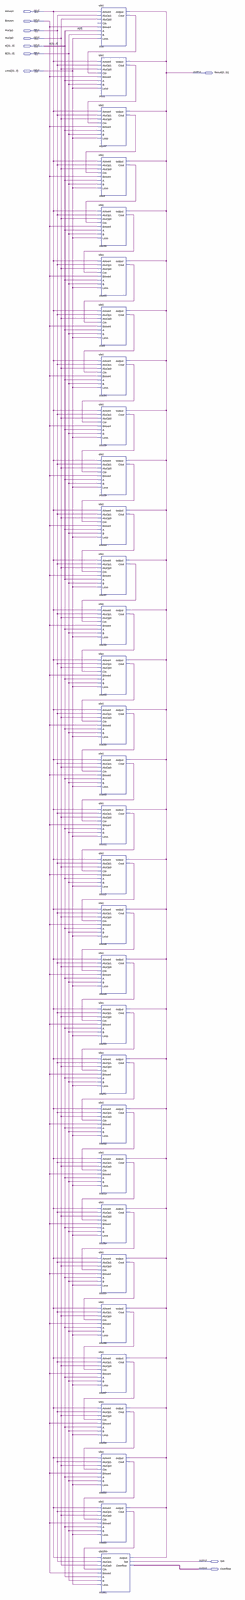
[diagram p0: schematic sheet, whole]
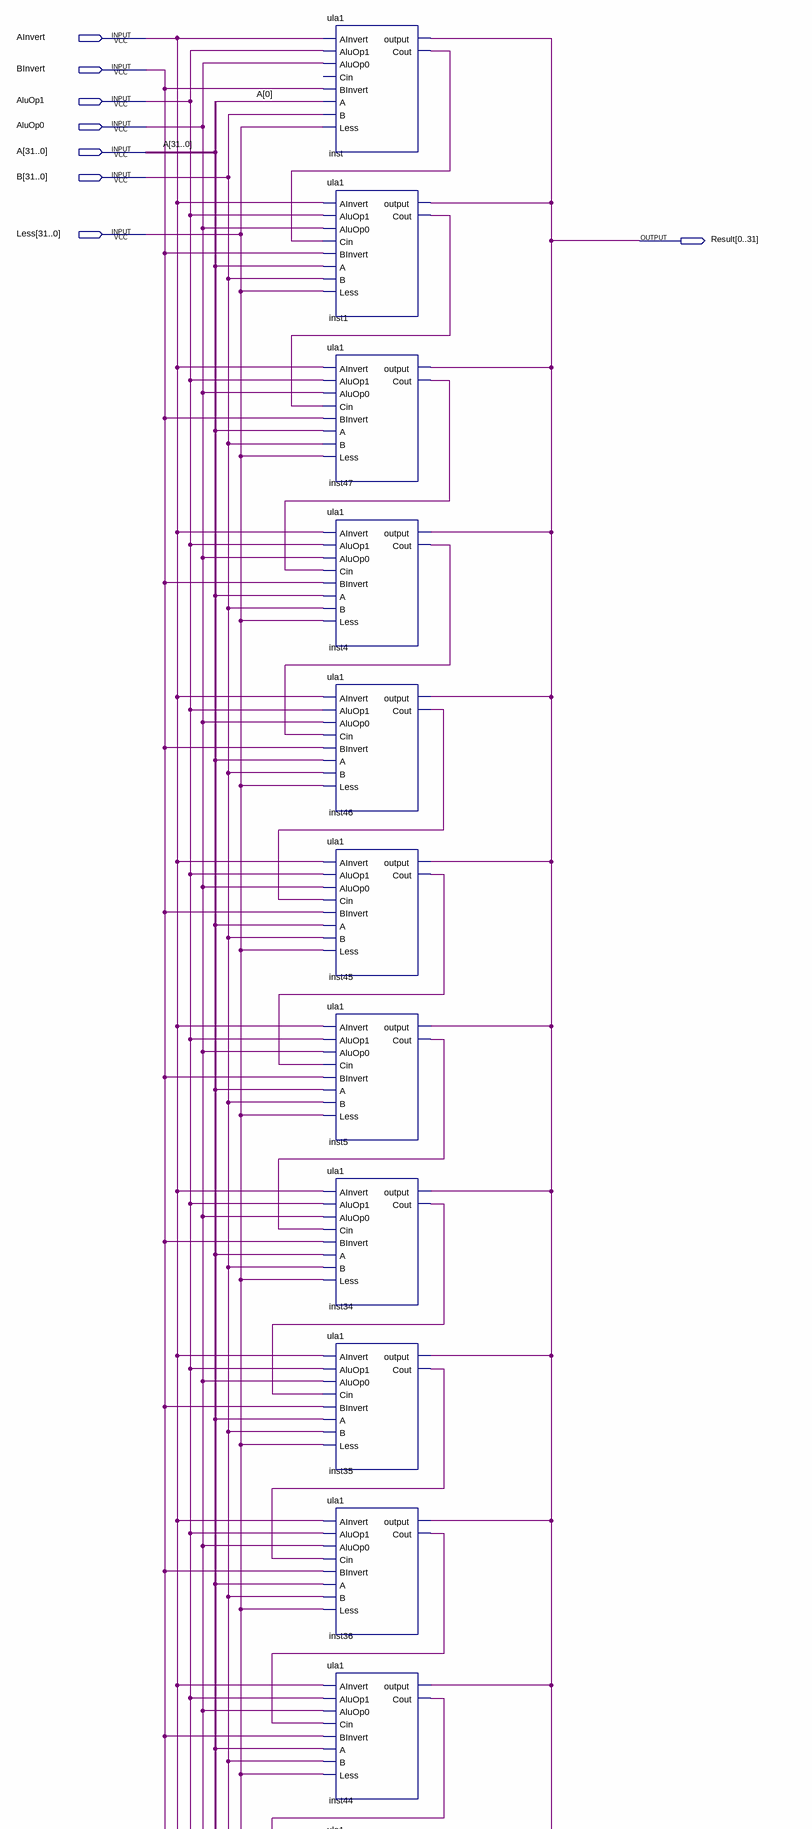
[diagram p1: schematic sheet, upper part]
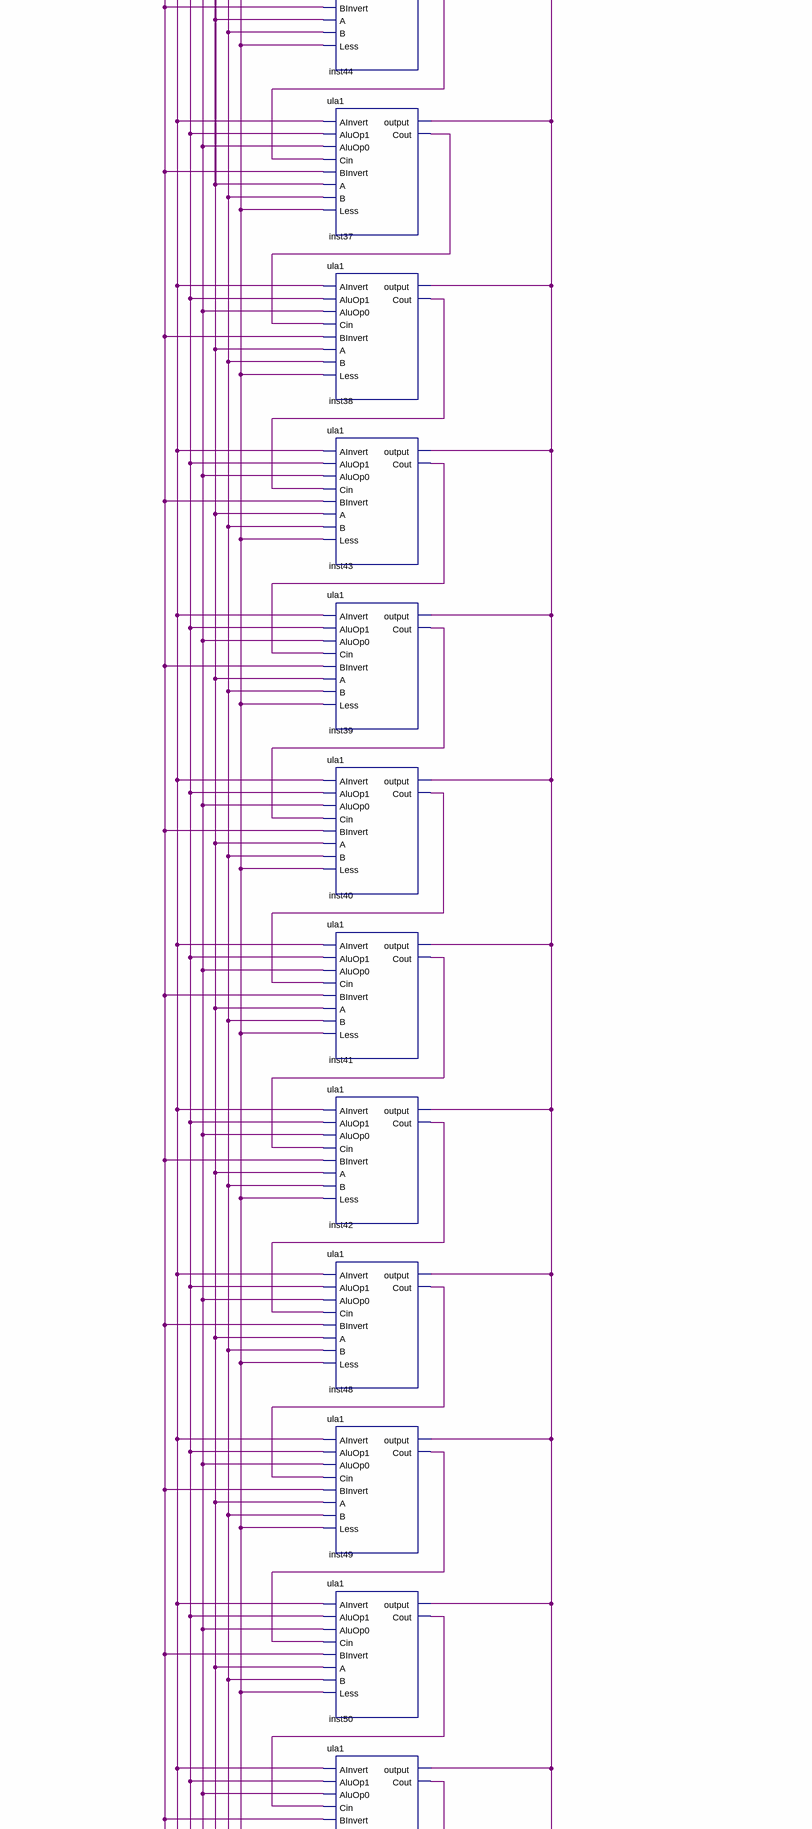
[diagram p2: schematic sheet, middle part]
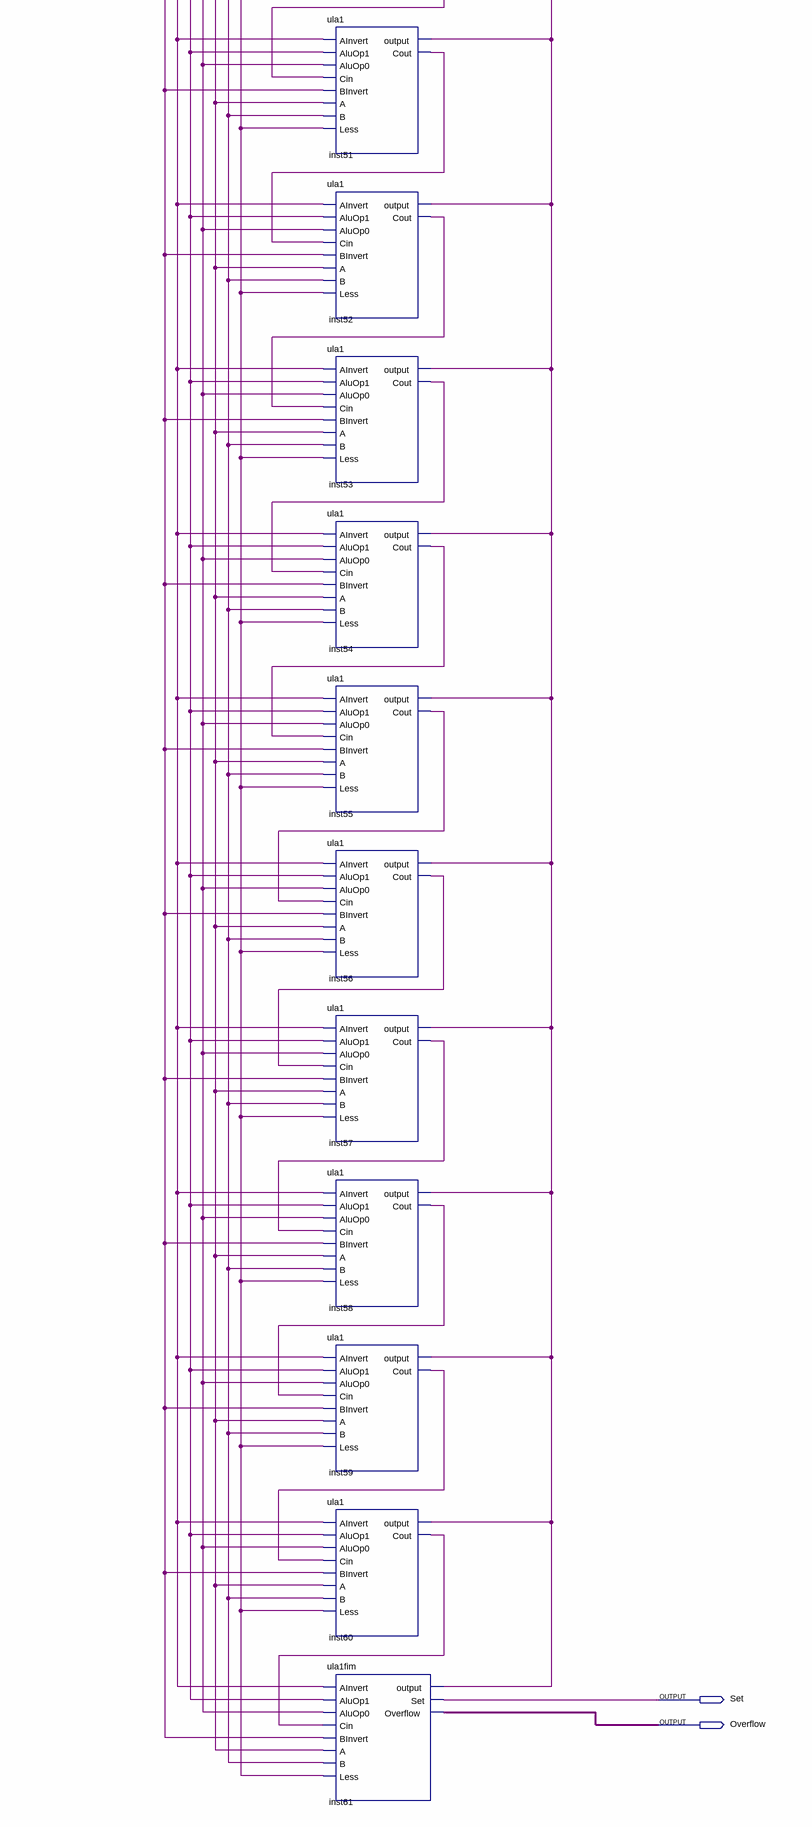
[diagram p3: schematic sheet, lower part]
// Quartus schematic ula32.bdf as structural Verilog: 32 symbols, 10 pins
module ula32 (
  input  AInvert,
  input  BInvert,
  input  AluOp1,
  input  AluOp0,
  input  [31:0] A,
  input  [31:0] B,
  input  [31:0] Less,
  output [0:31] Result,
  output Set,
  output Overflow
);

  wire inst1_cout, inst4_cout, inst5_cout, inst34_cout, inst35_cout, inst36_cout, inst37_cout, inst38_cout,
       inst39_cout, inst40_cout, inst41_cout, inst42_cout, inst43_cout, inst44_cout, inst45_cout,
       inst46_cout, inst47_cout, inst48_cout, inst49_cout, inst50_cout, inst51_cout, inst52_cout,
       inst53_cout, inst54_cout, inst55_cout, inst56_cout, inst57_cout, inst58_cout, inst59_cout,
       inst60_cout, inst_cout, inst_output, undriven, undriven_2, undriven_3, undriven_4, undriven_5,
       undriven_6, undriven_7, undriven_8, undriven_9, undriven_10, undriven_11, undriven_12, undriven_13;

  ula1 inst (
    .AInvert(AInvert), .AluOp1(AluOp1), .AluOp0(AluOp0), .BInvert(BInvert), .A(A[0]), .B(undriven_12),
    .Less(undriven_13), .\output (inst_output), .Cout(inst_cout));  // open: Cin
  ula1 inst1 (
    .AInvert(AInvert), .AluOp1(AluOp1), .AluOp0(AluOp0), .Cin(inst_cout), .BInvert(BInvert), .A(undriven),
    .B(undriven_12), .Less(undriven_13), .\output (inst_output), .Cout(inst1_cout));
  ula1 inst47 (
    .AInvert(AInvert), .AluOp1(AluOp1), .AluOp0(AluOp0), .Cin(inst1_cout), .BInvert(BInvert), .A(undriven_2),
    .B(undriven_12), .Less(undriven_13), .\output (inst_output), .Cout(inst47_cout));
  ula1 inst4 (
    .AInvert(AInvert), .AluOp1(AluOp1), .AluOp0(AluOp0), .Cin(inst47_cout), .BInvert(BInvert),
    .A(undriven_3), .B(undriven_12), .Less(undriven_13), .\output (inst_output), .Cout(inst4_cout));
  ula1 inst46 (
    .AInvert(AInvert), .AluOp1(AluOp1), .AluOp0(AluOp0), .Cin(inst4_cout), .BInvert(BInvert), .A(undriven_4),
    .B(undriven_12), .Less(undriven_13), .\output (inst_output), .Cout(inst46_cout));
  ula1 inst45 (
    .AInvert(AInvert), .AluOp1(AluOp1), .AluOp0(AluOp0), .Cin(inst46_cout), .BInvert(BInvert),
    .A(undriven_5), .B(undriven_12), .Less(undriven_13), .\output (inst_output), .Cout(inst45_cout));
  ula1 inst5 (
    .AInvert(AInvert), .AluOp1(AluOp1), .AluOp0(AluOp0), .Cin(inst45_cout), .BInvert(BInvert),
    .A(undriven_6), .B(undriven_12), .Less(undriven_13), .\output (inst_output), .Cout(inst5_cout));
  ula1 inst34 (
    .AInvert(AInvert), .AluOp1(AluOp1), .AluOp0(AluOp0), .Cin(inst5_cout), .BInvert(BInvert), .A(undriven_7),
    .B(undriven_12), .Less(undriven_13), .\output (inst_output), .Cout(inst34_cout));
  ula1 inst35 (
    .AInvert(AInvert), .AluOp1(AluOp1), .AluOp0(AluOp0), .Cin(inst34_cout), .BInvert(BInvert),
    .A(undriven_8), .B(undriven_12), .Less(undriven_13), .\output (inst_output), .Cout(inst35_cout));
  ula1 inst36 (
    .AInvert(AInvert), .AluOp1(AluOp1), .AluOp0(AluOp0), .Cin(inst35_cout), .BInvert(BInvert),
    .A(undriven_9), .B(undriven_12), .Less(undriven_13), .\output (inst_output), .Cout(inst36_cout));
  ula1 inst44 (
    .AInvert(AInvert), .AluOp1(AluOp1), .AluOp0(AluOp0), .Cin(inst36_cout), .BInvert(BInvert),
    .A(undriven_10), .B(undriven_12), .Less(undriven_13), .\output (inst_output), .Cout(inst44_cout));
  ula1 inst37 (
    .AInvert(AInvert), .AluOp1(AluOp1), .AluOp0(AluOp0), .Cin(inst44_cout), .BInvert(BInvert),
    .A(undriven_11), .B(undriven_12), .Less(undriven_13), .\output (inst_output), .Cout(inst37_cout));
  ula1 inst38 (
    .AInvert(AInvert), .AluOp1(AluOp1), .AluOp0(AluOp0), .Cin(inst37_cout), .BInvert(BInvert),
    .A(undriven_11), .B(undriven_12), .Less(undriven_13), .\output (inst_output), .Cout(inst38_cout));
  ula1 inst43 (
    .AInvert(AInvert), .AluOp1(AluOp1), .AluOp0(AluOp0), .Cin(inst38_cout), .BInvert(BInvert),
    .A(undriven_11), .B(undriven_12), .Less(undriven_13), .\output (inst_output), .Cout(inst43_cout));
  ula1 inst39 (
    .AInvert(AInvert), .AluOp1(AluOp1), .AluOp0(AluOp0), .Cin(inst43_cout), .BInvert(BInvert),
    .A(undriven_11), .B(undriven_12), .Less(undriven_13), .\output (inst_output), .Cout(inst39_cout));
  ula1 inst40 (
    .AInvert(AInvert), .AluOp1(AluOp1), .AluOp0(AluOp0), .Cin(inst39_cout), .BInvert(BInvert),
    .A(undriven_11), .B(undriven_12), .Less(undriven_13), .\output (inst_output), .Cout(inst40_cout));
  ula1 inst41 (
    .AInvert(AInvert), .AluOp1(AluOp1), .AluOp0(AluOp0), .Cin(inst40_cout), .BInvert(BInvert),
    .A(undriven_11), .B(undriven_12), .Less(undriven_13), .\output (inst_output), .Cout(inst41_cout));
  ula1 inst42 (
    .AInvert(AInvert), .AluOp1(AluOp1), .AluOp0(AluOp0), .Cin(inst41_cout), .BInvert(BInvert),
    .A(undriven_11), .B(undriven_12), .Less(undriven_13), .\output (inst_output), .Cout(inst42_cout));
  ula1 inst48 (
    .AInvert(AInvert), .AluOp1(AluOp1), .AluOp0(AluOp0), .Cin(inst42_cout), .BInvert(BInvert),
    .A(undriven_11), .B(undriven_12), .Less(undriven_13), .\output (inst_output), .Cout(inst48_cout));
  ula1 inst49 (
    .AInvert(AInvert), .AluOp1(AluOp1), .AluOp0(AluOp0), .Cin(inst48_cout), .BInvert(BInvert),
    .A(undriven_11), .B(undriven_12), .Less(undriven_13), .\output (inst_output), .Cout(inst49_cout));
  ula1 inst50 (
    .AInvert(AInvert), .AluOp1(AluOp1), .AluOp0(AluOp0), .Cin(inst49_cout), .BInvert(BInvert),
    .A(undriven_11), .B(undriven_12), .Less(undriven_13), .\output (inst_output), .Cout(inst50_cout));
  ula1 inst51 (
    .AInvert(AInvert), .AluOp1(AluOp1), .AluOp0(AluOp0), .Cin(inst50_cout), .BInvert(BInvert),
    .A(undriven_11), .B(undriven_12), .Less(undriven_13), .\output (inst_output), .Cout(inst51_cout));
  ula1 inst52 (
    .AInvert(AInvert), .AluOp1(AluOp1), .AluOp0(AluOp0), .Cin(inst51_cout), .BInvert(BInvert),
    .A(undriven_11), .B(undriven_12), .Less(undriven_13), .\output (inst_output), .Cout(inst52_cout));
  ula1 inst53 (
    .AInvert(AInvert), .AluOp1(AluOp1), .AluOp0(AluOp0), .Cin(inst52_cout), .BInvert(BInvert),
    .A(undriven_11), .B(undriven_12), .Less(undriven_13), .\output (inst_output), .Cout(inst53_cout));
  ula1 inst54 (
    .AInvert(AInvert), .AluOp1(AluOp1), .AluOp0(AluOp0), .Cin(inst53_cout), .BInvert(BInvert),
    .A(undriven_11), .B(undriven_12), .Less(undriven_13), .\output (inst_output), .Cout(inst54_cout));
  ula1 inst55 (
    .AInvert(AInvert), .AluOp1(AluOp1), .AluOp0(AluOp0), .Cin(inst54_cout), .BInvert(BInvert),
    .A(undriven_11), .B(undriven_12), .Less(undriven_13), .\output (inst_output), .Cout(inst55_cout));
  ula1 inst56 (
    .AInvert(AInvert), .AluOp1(AluOp1), .AluOp0(AluOp0), .Cin(inst55_cout), .BInvert(BInvert),
    .A(undriven_11), .B(undriven_12), .Less(undriven_13), .\output (inst_output), .Cout(inst56_cout));
  ula1 inst57 (
    .AInvert(AInvert), .AluOp1(AluOp1), .AluOp0(AluOp0), .Cin(inst56_cout), .BInvert(BInvert),
    .A(undriven_11), .B(undriven_12), .Less(undriven_13), .\output (inst_output), .Cout(inst57_cout));
  ula1 inst58 (
    .AInvert(AInvert), .AluOp1(AluOp1), .AluOp0(AluOp0), .Cin(inst57_cout), .BInvert(BInvert),
    .A(undriven_11), .B(undriven_12), .Less(undriven_13), .\output (inst_output), .Cout(inst58_cout));
  ula1 inst59 (
    .AInvert(AInvert), .AluOp1(AluOp1), .AluOp0(AluOp0), .Cin(inst58_cout), .BInvert(BInvert),
    .A(undriven_11), .B(undriven_12), .Less(undriven_13), .\output (inst_output), .Cout(inst59_cout));
  ula1 inst60 (
    .AInvert(AInvert), .AluOp1(AluOp1), .AluOp0(AluOp0), .Cin(inst59_cout), .BInvert(BInvert),
    .A(undriven_11), .B(undriven_12), .Less(undriven_13), .\output (inst_output), .Cout(inst60_cout));
  ula1fim inst61 (
    .AInvert(AInvert), .AluOp1(AluOp1), .AluOp0(AluOp0), .Cin(inst60_cout), .BInvert(BInvert),
    .A(undriven_11), .B(undriven_12), .Less(undriven_13), .\output (inst_output), .Set(Set),
    .Overflow(Overflow));
endmodule
